# Altium schematic sheet SAMD51.SchDoc
size A4
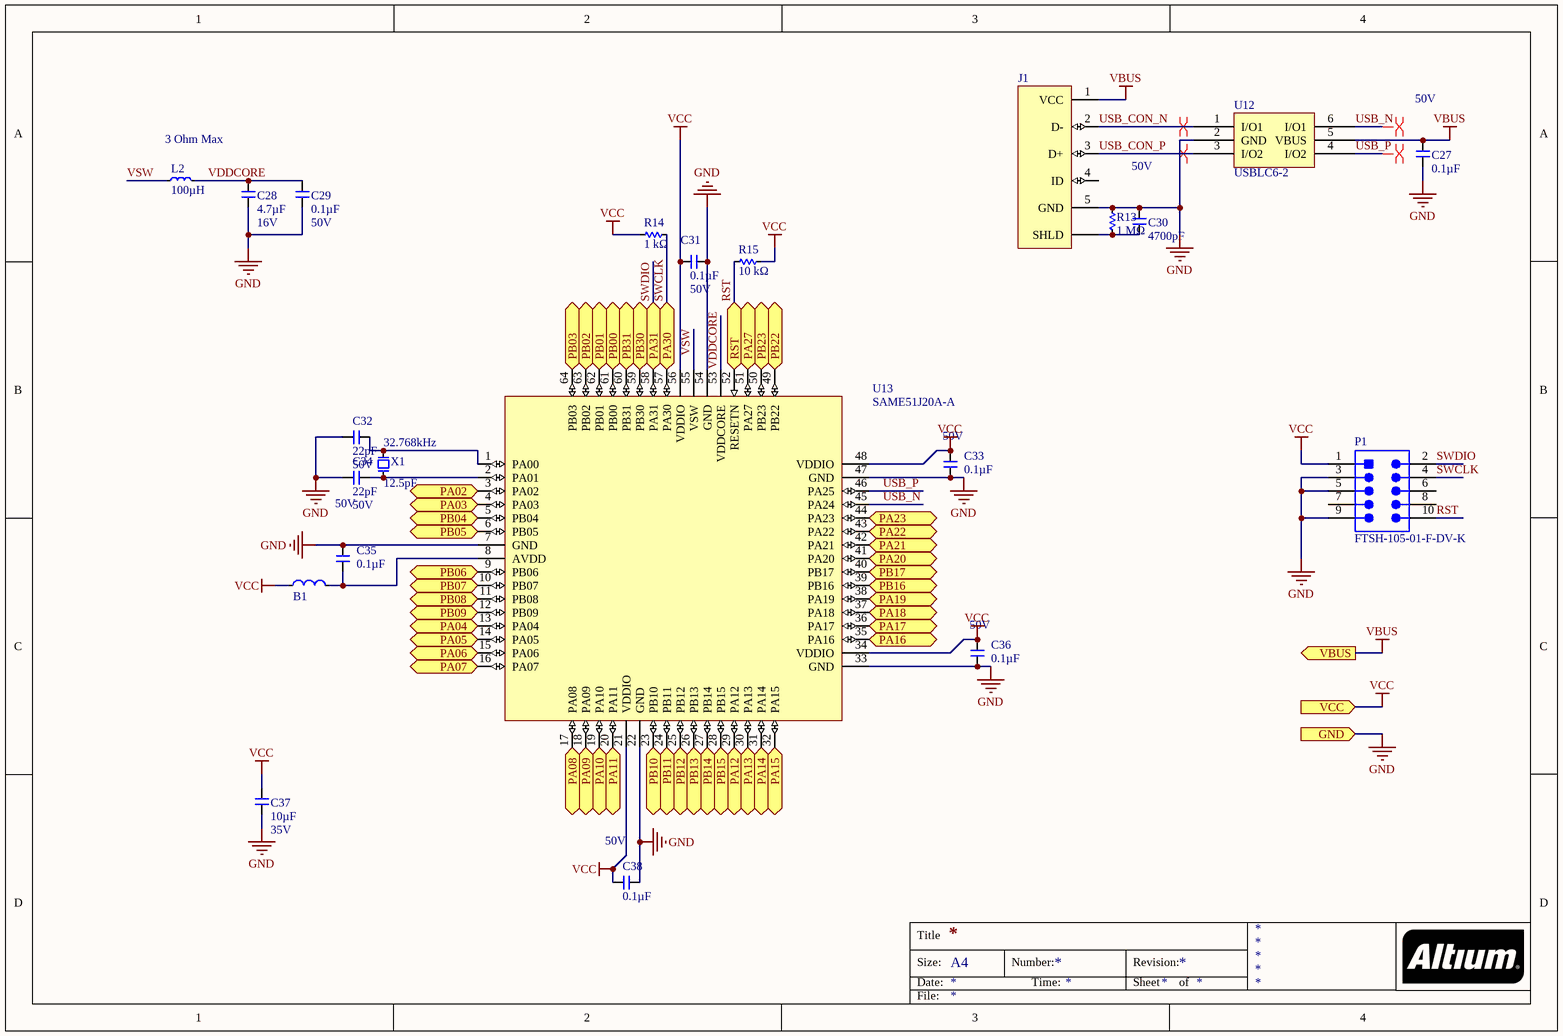
[diagram p0: SAMD51.SchDoc]

## Parts
B1  FB_1608  [R0603]  (value not drawn)
C27  Capacitance (shorthand): 0.1µF  Rated Voltage: 50V  [C0603]  (hidden comment: 490-1519-1-ND)
C28  Capacitance (shorthand): 4.7µF  Rated Voltage: 16V  [C0603]  (hidden comment: 311-1785-1-ND)
C29  Capacitance (shorthand): 0.1µF  Rated Voltage: 50V  [C0603]  (hidden comment: 490-1519-1-ND)
C30  Capacitance (shorthand): 4700pF  Rated Voltage: 50V  [C0603]  (hidden comment: 490-1506-1-ND)
C31  Capacitance (shorthand): 0.1µF  Rated Voltage: 50V  [C0603]  (hidden comment: 490-1519-1-ND)
C32  Capacitance (shorthand): 22pF  Rated Voltage: 50V  [C0603]  (hidden comment: 490-1411-1-ND)
C33  Capacitance (shorthand): 0.1µF  Rated Voltage: 50V  [C0603]  (hidden comment: 490-1519-1-ND)
C34  Capacitance (shorthand): 22pF  Rated Voltage: 50V  [C0603]  (hidden comment: 490-1411-1-ND)
C35  Capacitance (shorthand): 0.1µF  Rated Voltage: 50V  [C0603]  (hidden comment: 490-1519-1-ND)
C36  Capacitance (shorthand): 0.1µF  Rated Voltage: 50V  [C0603]  (hidden comment: 490-1519-1-ND)
C37  Capacitance (shorthand): 10µF  Rated Voltage: 35V  [C0603]  (hidden comment: 490-13248-1-ND)
C38  Capacitance (shorthand): 0.1µF  Rated Voltage: 50V  [C0603]  (hidden comment: 490-1519-1-ND)
J1  CONN_USB_MICROB_SMD_TH_R/A  [CONN_USBMICROB_10118194-0001LF]  (value not drawn)
L2  DC Resistance (DCR): 3 Ohm Max  Inductance: 100µH  [C1210]  (hidden comment: Symbol)
P1  FTSH-105-01-F-DV-K  [SMTC-FTSH-105-01-L-DV-K_V]
R13  Resistance: 1 MΩ  [R0603]  (hidden comment: 311-1.00MHRCT-ND)
R14  Resistance: 1 kΩ  [R0603]  (hidden comment: 311-1.00KHRCT-ND)
R15  Resistance: 10 kΩ  [R0603]  (hidden comment: 311-10.0KHRCT-ND)
U12  USBLC6-2  [6SOT23]
U13  SAME51J20A-A  [SAMD TQFP-64]
X1  Frequency: 32.768kHz  Load Capacitance: 12.5pF  [XTAL_TXC_9HT10]  (hidden comment: Symbol)

## Ports
GND (in), PA02 (bidir), PA03 (bidir), PA04 (bidir), PA05 (bidir), PA06 (bidir), PA07 (bidir), PA08 (bidir), PA09 (bidir), PA10 (bidir), PA11 (bidir), PA12 (bidir), PA13 (bidir), PA14 (bidir), PA15 (bidir), PA16 (bidir), PA17 (bidir), PA18 (bidir), PA19 (bidir), PA20 (bidir), PA21 (bidir), PA22 (bidir), PA23 (bidir), PA27 (bidir), PA30 (bidir), PA31 (bidir), PB00 (bidir), PB01 (bidir), PB02 (bidir), PB03 (bidir), PB04 (bidir), PB05 (bidir), PB06 (bidir), PB07 (bidir), PB08 (bidir), PB09 (bidir), PB10 (bidir), PB11 (bidir), PB12 (bidir), PB13 (bidir), PB14 (bidir), PB15 (bidir), PB16 (bidir), PB17 (bidir), PB22 (bidir), PB23 (bidir), PB30 (bidir), PB31 (bidir), RST (bidir), VBUS (out), VCC (in)

## Nets
GND: C27.2 C28.1 C29.2 C30.1 C31.1 C32.1 C33.1 C34.1 C35.1 C36.1 C37.1 C38.2 J1.5(GND) P1.3 P1.5 P1.9 R13.2 U12.2(GND) U13.7(GND) U13.22(GND) U13.33(GND) U13.47(GND) U13.54(GND) ; port GND
VBUS: C27.1 J1.1(VCC) U12.5(VBUS) ; port VBUS
VCC: B1.1 C31.2 C33.2 C36.2 C37.2 C38.1 P1.1 R14.2 R15.2 U13.21(VDDIO) U13.34(VDDIO) U13.48(VDDIO) U13.56(VDDIO) ; port VCC
PA02: U13.3(PA02) ; port PA02
PA03: U13.4(PA03) ; port PA03
PA04: U13.13(PA04) ; port PA04
PA05: U13.14(PA05) ; port PA05
PA06: U13.15(PA06) ; port PA06
PA07: U13.16(PA07) ; port PA07
PA08: U13.17(PA08) ; port PA08
PA09: U13.18(PA09) ; port PA09
PA10: U13.19(PA10) ; port PA10
PA11: U13.20(PA11) ; port PA11
PA12: U13.29(PA12) ; port PA12
PA13: U13.30(PA13) ; port PA13
PA14: U13.31(PA14) ; port PA14
PA15: U13.32(PA15) ; port PA15
PA16: U13.35(PA16) ; port PA16
PA17: U13.36(PA17) ; port PA17
PA18: U13.37(PA18) ; port PA18
PA19: U13.38(PA19) ; port PA19
PA20: U13.41(PA20) ; port PA20
PA21: U13.42(PA21) ; port PA21
PA22: U13.43(PA22) ; port PA22
PA23: U13.44(PA23) ; port PA23
PA27: U13.51(PA27) ; port PA27
PB00: U13.61(PB00) ; port PB00
PB01: U13.62(PB01) ; port PB01
PB02: U13.63(PB02) ; port PB02
PB03: U13.64(PB03) ; port PB03
PB04: U13.5(PB04) ; port PB04
PB05: U13.6(PB05) ; port PB05
PB06: U13.9(PB06) ; port PB06
PB07: U13.10(PB07) ; port PB07
PB08: U13.11(PB08) ; port PB08
PB09: U13.12(PB09) ; port PB09
PB10: U13.23(PB10) ; port PB10
PB11: U13.24(PB11) ; port PB11
PB12: U13.25(PB12) ; port PB12
PB13: U13.26(PB13) ; port PB13
PB14: U13.27(PB14) ; port PB14
PB15: U13.28(PB15) ; port PB15
PB16: U13.39(PB16) ; port PB16
PB17: U13.40(PB17) ; port PB17
PB22: U13.49(PB22) ; port PB22
PB23: U13.50(PB23) ; port PB23
PB30: U13.59(PB30) ; port PB30
PB31: U13.60(PB31) ; port PB31
RST: P1.10 R15.1 U13.52(RESETN) ; port RST
SWCLK: P1.4 R14.1 U13.57(PA30) ; port PA30
SWDIO: P1.2 U13.58(PA31) ; port PA31
USB_CON_N: J1.2(D-) U12.1(I/O1)
USB_CON_P: J1.3(D+) U12.3(I/O2)
USB_N: U12.6(I/O1) U13.45(PA24)
USB_P: U12.4(I/O2) U13.46(PA25)
VDDCORE: C28.2 C29.1 L2.1 U13.53(VDDCORE)
VSW: L2.2 U13.55(VSW)
NetB1_2: B1.2 C35.2 U13.8(AVDD)
NetC30_2: C30.2 J1.SHIELD(SHLD) R13.1
NetC32_2: C32.2 U13.1(PA00) X1.2
NetC34_2: C34.2 U13.2(PA01) X1.1

Not connected (* = marked no-connect by the designer): J1 4(ID); P1 6 7 8

## Layout directives
differential pair: USB_CON_N, USB_CON_P, USB_N, USB_P

## Notes on the sheet
- Title
- Size:
- Date:
- A4
- Number:
- Time:
- Revision:
- Sheet
- of
- File:

## Library data of the parts
B1 = CMP-051-0000-1: FERRITE BEAD 600 OHM 300mA; Manufacturer: Taiyo Yuden; Manufacturer Part Number: BK1608HW601-T; Number of Lines: 1; Impedance @ Frequency: 600 Ohm @ 100MHz; DC Resistance (DCR) (Max): 400 mOhm; RoHS: RoHS Compliant; Stock 1: 11908; Pricing 1: 1=0.1, 10=0.059, 50=0.0474, 100=0.0426, 250=0.0312, 500=0.0227, 1000=0.02223 (USD); Packaging: Cut Tape (CT); Part Status: Active; Filter Type: -; Current Rating (Max): 300mA; Ratings: -; Operating Temperature: -55°C ~ 125°C; Package / Case: 0603 (1608 Metric); Mounting Type: Surface Mount; Height (Max): 0.037" (0.95mm); Size / Dimension: 0.063" L x 0.031" W (1.60mm x 0.80mm); ComponentLink1URL: http://ds.yuden.co.jp/TYCOMPAS/ut/detail.do?productNo=BK1608HW601-T&fileName=BK1608HW601-T_SS&mode=specSheetDownload; ComponentLink1Description: http://ds.yuden.co.jp/TYCOMPAS/ut/detail.do?productNo=BK1608HW601-T&fileName=BK1608HW601-T_SS&mode=specSheetDownload; Design Item ID: FB_1608; Source: inductor.SchLib
C27 C29 C31 C33 C35 C36 C38 = CMP-119-0065-1: CAP CER 0603 0.1µF X7R 50V 10%; Manufacturer: Murata Electronics North America; Capacitance - pF (Machine readable): #NAME?; Dielectric: X7R
C28 = CMP-119-0070-1: CAP CER 4.7UF 16V X5R 0603 10%; Manufacturer: Yageo; Capacitance - pF (Machine readable): #NAME?; Dielectric: X5R
C30 = CMP-119-0049-1: CAP CER 0603 4700pF X7R 50V 10%; Manufacturer: Murata Electronics North America; Capacitance - pF (Machine readable): #NAME?; Dielectric: X7R
C32 C34 = CMP-119-0008-1: CAP CER 22PF 50V C0G/NP0 0603; Manufacturer: Murata Electronics North America; Capacitance - pF (Machine readable): 22; Dielectric: C0G, NP0
C37 = CMP-119-0071-1: CAP CER 10UF 35V X5R 0603 20%; Manufacturer: Murata Electronics North America; Capacitance - pF (Machine readable): #NAME?; Dielectric: X5R
J1 = CMP-029-0083-1: CONN RCPT USB2.0 MICRO B SMD R/A; Manufacturer: Amphenol FCI; Manufacturer Part Number: 10118194-0001LF; Gender: Receptacle; Current Rating: 1.8A; Connector Type: USB,Receptacle; Number of Contacts: 5; Insulation Resistance: 1GR; Number of Ports: 1; Max Voltage Rating (AC): 100V; Pitch: 0.65mm; Stock 1: 180464; Pricing 1: 1=0.46, 10=0.437, 25=0.3744, 50=0.318, 100=0.3056, 250=0.2744, 500=0.262 (USD); Mount: Surface Mount,Horizontal; Contact Material: Copper Alloy; Contact Plating: Nickel,Gold; Number of Terminals: 5; Housing Material: Polymer; Colour: Black; Min Operating Temperature: -55°C; Max Operating Temperature: 85°C; Package Quantity: 9600; Packaging: Tape and Reel; Termination: Solder; Orientation: Right Angle; Length: 8.05mm; Depth: 5mm; Radiation Hardening: No; Lead Free: Lead Free; Flammability Rating: UL94 V-0; ComponentLink1URL: https://datasheet.ciiva.com/851/10118194-851110.pdf; ComponentLink1Description: https://datasheet.ciiva.com/851/10118194-851110.pdf; ComponentLink2URL: https://datasheet.ciiva.com/851/10118194-851111.pdf; ComponentLink2Description: https://datasheet.ciiva.com/851/10118194-851111.pdf; ComponentLink3URL: https://datasheet.ciiva.com/4598/10118194ac-197217-4598807.pdf; ComponentLink3Description: https://datasheet.ciiva.com/4598/10118194ac-197217-4598807.pdf; ComponentLink4URL: https://datasheet.ciiva.com/29907/10118194-29907230.pdf; ComponentLink4Description: https://datasheet.ciiva.com/29907/10118194-29907230.pdf; ComponentLink5URL: https://datasheet.ciiva.com/26945/getdatasheetpartid-418619-26945695.pdf; ComponentLink5Description: https://datasheet.ciiva.com/26945/getdatasheetpartid-418619-26945695.pdf; Design Item ID: CONN_USB_MICROB_SMD_TH_R/A; Source: connector.SchLib
L2 = CMP-052-0010-1: INDUCTOR 100UH 270MA 1210 SMD; Manufacturer: Taiyo Yuden; Manufacturer Part Number: BRL3225T101K; Current - Temperature Rise: 250mA; Tolerance: ±10%; Shielding: Unshielded; Frequency - Self Resonant: 5MHz; Frequency - Test: 100kHz; RoHS: RoHS Compliant; Current - Saturation: 270mA; Q @ Freq: -; Applications: Power Supplies; Material - Core: -; Package / Case: 1210 (3225 Metric); Mounting Type: Surface Mount; Packaging: Cut Tape (CT); Operating Temperature: -40°C ~ 105°C; ComponentLink1URL: http://www.yuden.co.jp/ut/product/pdf/wound07_e.pdf; ComponentLink1Description: Datasheet; Current: 270mA; Stock 1: 84687; Pricing 1: 1=0.16, 10=0.155, 50=0.145, 100=0.1354, 500=0.10638, 1000=0.08704 (GBP); Design Item ID: IND_BRL3225T101K; Source: inductor.SchLib
P1 = CMP-2000-05352-1: Male Header, Pitch 1.27 mm, 2 x 5 Position, Height 6.12 mm, RoHS, Tube; Manufacturer: Samtec; Number of Positions: 10; Connector Type: Header,Shrouded; Number of Positions Loaded: All; Row Spacing: 0.050"(1.27mm); Fastening Type: -; Package Reference: FTSH-105-01-L-DV-K; Termination: Solder; Package URL: http://suddendocs.samtec.com/prints/ftsh-1xx-xx-xxx-dv-xxx-footprint.pdf; Number of Rows: 2; Contact Finish Thickness: 3µin(0.08µm); Contact Type: MalePin; Manufacturer URL: http://www.samtec.com/; Series: FTSH; Features: -; Contact Finish: Gold; Color: Black; Family: RectangularConnectors-Headers,MalePins; Datasheet URL: http://suddendocs.samtec.com/prints/ftsh-1xx-xx-xxx-dv-xxx-mkt.pdf; Package Description: Male Header, Pitch 1.27 mm, 2 x 5 Position, Height 5.97 mm, Tail Length 4.32 mm; Mounting Type: SurfaceMount; Datasheet Version: Rev. ET, 10/1995; Category: Connectors,Interconnects; Packaging: Tube; Contact Mating Length: 0.120"(3.05mm); Pitch: 0.050"(1.27mm)
R13 = CMP-126-0484-2: RES SMD 1M OHM 1% 1/10W 0603; Manufacturer Part Number: RC0603FR-071ML; Manufacturer: Yageo; Resistance (Sortable): 1000000; Power (Watts): 0.1W, 1/10W; Temperature Coefficient: ±100ppm/°C; Datasheets: http://www.yageo.com/documents/recent/PYu-RC_Group_51_RoHS_L_9.pdf; Image: //media.digikey.com/Renders/Yageo%20Renders/0603-(1608-Metric).jpg; Tolerance: ±1%; Operating Temperature: -55°C ~ 155°C
R14 = CMP-126-0172-2: RES SMD 1K OHM 1% 1/10W 0603; Manufacturer Part Number: RC0603FR-071KL; Manufacturer: Yageo; Resistance (Sortable): 1000; Power (Watts): 0.1W, 1/10W; Temperature Coefficient: ±100ppm/°C; Datasheets: http://www.yageo.com/documents/recent/PYu-RC_Group_51_RoHS_L_9.pdf; Image: //media.digikey.com/Renders/Yageo%20Renders/0603-(1608-Metric).jpg; Tolerance: ±1%; Operating Temperature: -55°C ~ 155°C
R15 = CMP-126-0273-2: RES SMD 10K OHM 1% 1/10W 0603; Manufacturer Part Number: RC0603FR-0710KL; Manufacturer: Yageo; Resistance (Sortable): 10000; Power (Watts): 0.1W, 1/10W; Temperature Coefficient: ±100ppm/°C; Datasheets: http://www.yageo.com/documents/recent/PYu-RC_Group_51_RoHS_L_9.pdf; Image: //media.digikey.com/Renders/Yageo%20Renders/0603-(1608-Metric).jpg; Tolerance: ±1%; Operating Temperature: -55°C ~ 155°C
U12 = CMP-038-0001-1: Manufacturer: STMicroelectronics; Manufacturer Part Number: USBLC6-2SC6; Unidirectional Channels: 2; Voltage - Reverse Standoff (Typ): 5.25V; Voltage - Breakdown (Min): 6V; Voltage - Clamping (Max) @ Ipp: 17V; Current - Peak Pulse (10/1000µs): 5A (8/20µs); Power Line Protection: Yes; RoHS: RoHS Compliant; Stock 1: 31719; Pricing 1: 1=0.51, 10=0.411, 100=0.2802, 500=0.21012, 1000=0.15759 (USD); Packaging: Cut Tape (CT); Part Status: Active; Bidirectional Channels: -; Power - Peak Pulse: -; Applications: Ethernet; Capacitance @ Frequency: -; Operating Temperature: -40°C ~ 125°C (TJ); Mounting Type: Surface Mount; Package / Case: SOT-23-6; Supplier Device Package: SOT-23-6; ComponentLink1URL: http://www.st.com/web/en/resource/technical/document/datasheet/CD00050750.pdf; ComponentLink1Description: http://www.st.com/web/en/resource/technical/document/datasheet/CD00050750.pdf; Design Item ID: USBLC6-2; Source: ic_analog.SchLib
U13 = CMP-049-0005-1: Atmel SAM ARM Cortex M4; ComponentLink1Description: Product Page; ComponentLink1URL: https://www.microchip.com/wwwproducts/en/ATSAMD21G18; ComponentLink2Description: Datasheet; ComponentLink2URL: http://ww1.microchip.com/downloads/en/DeviceDoc/SAM-D21-Family-Datasheet-DS40001882C.pdf; Design Item ID: SAME51J20A-A; Source: ic_processor.SchLib
X1 = CMP-066-0008-1: CRYSTAL 32.768 KHZ 12.5 PF SMD; Manufacturer: TXC CORPORATION; Manufacturer Part Number: 9HT10-32.768KEZF-T; Frequency Tolerance: ±10ppm; ESR (Equivalent Series Resistance): 70 kOhm; Operating Mode: Fundamental; RoHS: RoHS Compliant; Stock 1: 5250; Pricing 1: 1=1.88, 10=1.625, 50=1.425, 100=1.125, 500=0.95, 1000=0.75 (USD); Frequency Stability: -; Operating Temperature: -40°C ~ 85°C; Ratings: -; Mounting Type: Surface Mount; Package / Case: 2-SMD; Size / Dimension: 0.126" L x 0.059" W (3.20mm x 1.50mm); Height: 0.033" (0.85mm); Packaging: Cut Tape (CT); ComponentLink1URL: http://www.txccrystal.com/images/pdf/9ht10.pdf; ComponentLink1Description: Datasheet; Design Item ID: XTAL_9HT10-32.768KEZF-T; Source: oscillator.SchLib